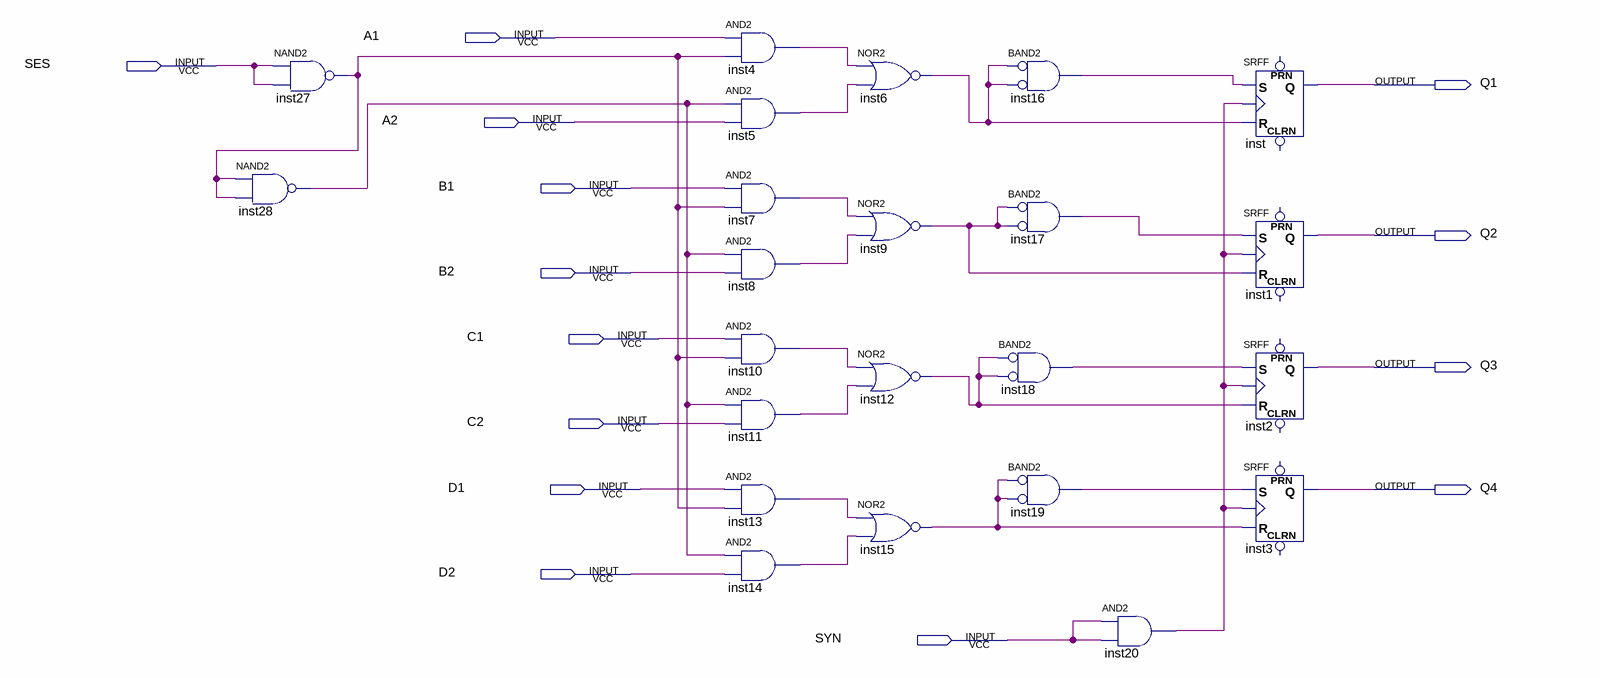
[diagram p0: schematic sheet]
// Quartus schematic kp1533KP13.bdf as structural Verilog: 23 symbols, 14 pins
module kp1533KP13 (
  input  A1,
  input  SES,
  input  A2,
  input  B1,
  input  B2,
  input  C1,
  input  C2,
  input  D1,
  input  D2,
  input  SYN,
  output Q1,
  output Q2,
  output Q3,
  output Q4
);

  wire inst4_out, inst5_out, inst6_out, inst7_out, inst8_out, inst9_out, inst10_out, inst11_out, inst12_out,
       inst13_out, inst14_out, inst15_out, inst16_out, inst17_out, inst18_out, inst19_out, inst20_out,
       inst27_out, inst28_out;

  nand inst28 (inst28_out, inst27_out, inst27_out);
  nand inst27 (inst27_out, SES, SES);
  and inst4 (inst4_out, A1, inst27_out);
  and inst5 (inst5_out, inst28_out, A2);
  and inst7 (inst7_out, B1, inst27_out);
  and inst8 (inst8_out, inst28_out, B2);
  and inst10 (inst10_out, C1, inst27_out);
  and inst11 (inst11_out, inst28_out, C2);
  and inst13 (inst13_out, D1, inst27_out);
  and inst14 (inst14_out, inst28_out, D2);
  nor inst6 (inst6_out, inst4_out, inst5_out);
  nor inst9 (inst9_out, inst7_out, inst8_out);
  nor inst12 (inst12_out, inst10_out, inst11_out);
  nor inst15 (inst15_out, inst13_out, inst14_out);
  and inst18 (inst18_out, ~inst12_out, ~inst12_out);  // BAND2
  and inst16 (inst16_out, ~inst6_out, ~inst6_out);  // BAND2
  and inst17 (inst17_out, ~inst9_out, ~inst9_out);  // BAND2
  and inst19 (inst19_out, ~inst15_out, ~inst15_out);  // BAND2
  and inst20 (inst20_out, SYN, SYN);
  SRFF inst (.S(inst16_out), .R(inst6_out), .CLK(inst20_out), .Q(Q1));  // open: PRN, CLRN
  SRFF inst1 (.S(inst17_out), .R(inst9_out), .CLK(inst20_out), .Q(Q2));  // open: PRN, CLRN
  SRFF inst2 (.S(inst18_out), .R(inst12_out), .CLK(inst20_out), .Q(Q3));  // open: PRN, CLRN
  SRFF inst3 (.S(inst19_out), .R(inst15_out), .CLK(inst20_out), .Q(Q4));  // open: PRN, CLRN
endmodule
